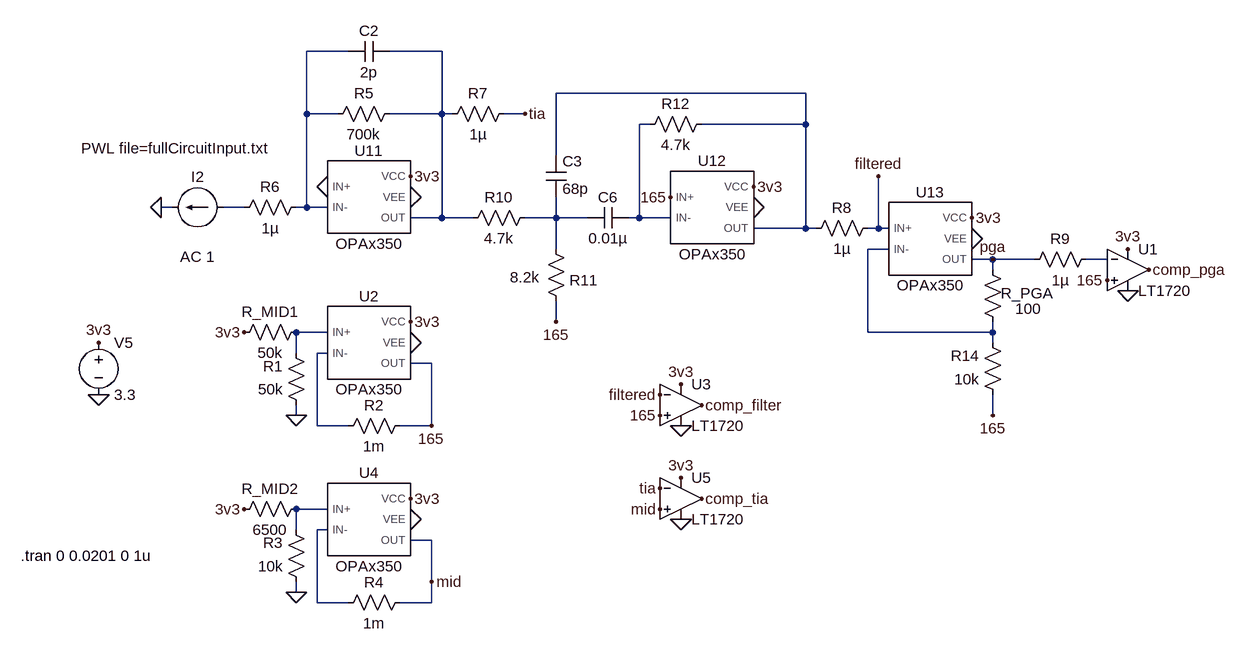
[diagram p0: schematic circuit_full.asc]
circuit_full.asc, the LTspice schematic file:
Version 4.1
SHEET 1 1996 1696
WIRE 0 800 -64 800
WIRE 144 800 64 800
WIRE 704 864 320 864
WIRE -64 896 -64 800
WIRE -16 896 -64 896
WIRE 144 896 144 800
WIRE 144 896 64 896
WIRE 160 896 144 896
WIRE 272 896 240 896
WIRE 464 912 448 912
WIRE 704 912 704 864
WIRE 704 912 544 912
WIRE 320 960 320 864
WIRE -272 1040 -288 1040
WIRE -160 1040 -192 1040
WIRE -64 1040 -64 896
WIRE -64 1040 -80 1040
WIRE -32 1040 -64 1040
WIRE 144 1056 144 896
WIRE 144 1056 96 1056
WIRE 192 1056 144 1056
WIRE 320 1056 320 1024
WIRE 320 1056 272 1056
WIRE 368 1056 320 1056
WIRE 448 1056 448 912
WIRE 448 1056 432 1056
WIRE 496 1056 448 1056
WIRE 704 1072 704 912
WIRE 704 1072 624 1072
WIRE 720 1072 704 1072
WIRE 816 1072 816 992
WIRE 816 1072 800 1072
WIRE 832 1072 816 1072
WIRE 320 1104 320 1056
WIRE 832 1104 800 1104
WIRE 992 1120 960 1120
WIRE 1056 1120 992 1120
WIRE 1168 1120 1136 1120
WIRE 992 1136 992 1120
WIRE 320 1216 320 1184
WIRE -32 1232 -80 1232
WIRE 800 1232 800 1104
WIRE 992 1232 992 1216
WIRE 992 1232 800 1232
WIRE 992 1248 992 1232
WIRE -80 1264 -80 1232
WIRE -32 1264 -48 1264
WIRE 128 1280 96 1280
WIRE -80 1360 -80 1344
WIRE 992 1360 992 1328
WIRE -48 1376 -48 1264
WIRE 0 1376 -48 1376
WIRE 128 1376 128 1280
WIRE 128 1376 80 1376
WIRE -32 1504 -80 1504
WIRE -80 1536 -80 1504
WIRE -32 1536 -48 1536
WIRE 128 1552 96 1552
WIRE 128 1616 128 1552
WIRE -80 1632 -80 1616
WIRE -48 1648 -48 1536
WIRE 0 1648 -48 1648
WIRE 128 1648 128 1616
WIRE 128 1648 80 1648
FLAG 96 992 3v3
FLAG 96 1024 0
FLAG -288 1040 0
FLAG 624 1008 3v3
FLAG 624 1040 0
FLAG 816 992 filtered
FLAG -384 1328 0
FLAG -384 1248 3v3
FLAG 320 1216 165
FLAG 496 1024 165
FLAG 960 1056 3v3
FLAG 960 1088 0
FLAG 992 1360 165
FLAG 1168 1152 165
FLAG 1200 1104 3v3
FLAG 1200 1168 0
FLAG 480 1328 filtered
FLAG 1232 1136 comp_pga
FLAG 544 1344 comp_filter
FLAG -32 1008 0
FLAG 480 1360 165
FLAG 512 1312 3v3
FLAG 512 1376 0
FLAG 992 1120 pga
FLAG -80 1360 0
FLAG -160 1232 3v3
FLAG 96 1216 3v3
FLAG 96 1248 0
FLAG -80 1632 0
FLAG -160 1504 3v3
FLAG 96 1488 3v3
FLAG 96 1520 0
FLAG 128 1616 mid
FLAG 128 1376 165
FLAG 544 1488 comp_tia
FLAG 512 1456 3v3
FLAG 512 1520 0
FLAG 480 1504 mid
FLAG 272 896 tia
FLAG 480 1472 tia
SYMBOL res 80 880 R90
WINDOW 0 0 56 VBottom 2
WINDOW 3 32 56 VTop 2
SYMATTR InstName R5
SYMATTR Value 700k
SYMBOL cap 64 784 R90
WINDOW 0 0 32 VBottom 2
WINDOW 3 32 32 VTop 2
SYMATTR InstName C2
SYMATTR Value 2p
SYMBOL res -64 1024 R90
WINDOW 0 0 56 VBottom 2
WINDOW 3 32 56 VTop 2
SYMATTR InstName R6
SYMATTR Value 1µ
SYMBOL current -192 1040 R90
WINDOW 0 -32 40 VBottom 2
WINDOW 3 -107 75 VTop 2
WINDOW 123 60 40 VTop 2
WINDOW 39 0 0 Left 0
SYMATTR InstName I2
SYMATTR Value PWL file=fullCircuitInput.txt
SYMATTR Value2 AC 1
SYMBOL LTSpiceModels\\sbom071e\\OPAx350 32 1024 R0
SYMATTR InstName U11
SYMBOL res 288 1040 R90
WINDOW 0 0 56 VBottom 2
WINDOW 3 32 56 VTop 2
SYMATTR InstName R10
SYMATTR Value 4.7k
SYMBOL res 336 1200 R180
WINDOW 0 -49 48 Left 2
WINDOW 3 41 53 Left 2
SYMATTR InstName R11
SYMATTR Value 8.2k
SYMBOL cap 304 960 R0
WINDOW 0 26 9 Left 2
WINDOW 3 26 51 Left 2
SYMATTR InstName C3
SYMATTR Value 68p
SYMBOL cap 432 1040 R90
WINDOW 0 0 32 VBottom 2
WINDOW 3 32 32 VTop 2
SYMATTR InstName C6
SYMATTR Value 0.01µ
SYMBOL res 560 896 R90
WINDOW 0 0 56 VBottom 2
WINDOW 3 32 56 VTop 2
SYMATTR InstName R12
SYMATTR Value 4.7k
SYMBOL LTSpiceModels\\sbom071e\\OPAx350 560 1040 R0
SYMATTR InstName U12
SYMBOL voltage -384 1232 R0
WINDOW 123 0 0 Left 0
WINDOW 39 0 0 Left 0
SYMATTR InstName V5
SYMATTR Value 3.3
SYMBOL LTSpiceModels\\sbom071e\\OPAx350 896 1088 R0
SYMATTR InstName U13
SYMBOL res 1008 1232 R180
WINDOW 0 -77 60 Left 2
WINDOW 3 -59 36 Left 2
SYMATTR InstName R_PGA
SYMATTR Value 100
SYMBOL res 1008 1344 R180
WINDOW 0 36 76 Left 2
WINDOW 3 36 40 Left 2
SYMATTR InstName R14
SYMATTR Value 10k
SYMBOL Comparators\\LT1720 1200 1072 R0
SYMATTR InstName U1
SYMBOL Comparators\\LT1720 512 1280 R0
SYMATTR InstName U3
SYMBOL LTSpiceModels\\sbom071e\\OPAx350 32 1248 R0
SYMATTR InstName U2
SYMBOL res -64 1216 R90
WINDOW 0 0 56 VBottom 2
WINDOW 3 32 56 VTop 2
SYMATTR InstName R_MID1
SYMATTR Value 50k
SYMBOL res -64 1360 R180
WINDOW 0 36 76 Left 2
WINDOW 3 36 40 Left 2
SYMATTR InstName R1
SYMATTR Value 50k
SYMBOL res 96 1360 R90
WINDOW 0 0 56 VBottom 2
WINDOW 3 32 56 VTop 2
SYMATTR InstName R2
SYMATTR Value 1m
SYMBOL LTSpiceModels\\sbom071e\\OPAx350 32 1520 R0
SYMATTR InstName U4
SYMBOL res -64 1488 R90
WINDOW 0 0 56 VBottom 2
WINDOW 3 32 56 VTop 2
SYMATTR InstName R_MID2
SYMATTR Value 6500
SYMBOL res -64 1632 R180
WINDOW 0 36 76 Left 2
WINDOW 3 36 40 Left 2
SYMATTR InstName R3
SYMATTR Value 10k
SYMBOL res 96 1632 R90
WINDOW 0 0 56 VBottom 2
WINDOW 3 32 56 VTop 2
SYMATTR InstName R4
SYMATTR Value 1m
SYMBOL Comparators\\LT1720 512 1424 R0
SYMATTR InstName U5
SYMBOL res 256 880 R90
WINDOW 0 0 56 VBottom 2
WINDOW 3 32 56 VTop 2
SYMATTR InstName R7
SYMATTR Value 1µ
SYMBOL res 816 1056 R90
WINDOW 0 0 56 VBottom 2
WINDOW 3 32 56 VTop 2
SYMATTR InstName R8
SYMATTR Value 1µ
SYMBOL res 1152 1104 R90
WINDOW 0 0 56 VBottom 2
WINDOW 3 32 56 VTop 2
SYMATTR InstName R9
SYMATTR Value 1µ
TEXT -504 1576 Left 2 !.tran 0 0.0201 0 1u

The netlist it stands for:
* circuit_full.asc
R5 N002 N001 700k
C2 N002 N001 2p
R6 N001 N005 1µ
I2 N005 0 PWL file=fullCircuitInput.txt AC 1
X§U11 0 N001 3v3 0 N002 OPAx350  ; pins IN+ IN- VCC VEE OUT
R10 N006 N002 4.7k
R11 165 N006 8.2k
C3 N003 N006 68p
C6 N004 N006 0.01µ
R12 N003 N004 4.7k
X§U12 165 N004 3v3 0 N003 OPAx350  ; pins IN+ IN- VCC VEE OUT
V5 3v3 0 3.3
X§U13 filtered N007 3v3 0 pga OPAx350  ; pins IN+ IN- VCC VEE OUT
R_PGA N007 pga 100
R14 165 N007 10k
X§U1 165 N008 3v3 0 comp_pga LT1720  ; pins In+ In- V+ V- OUT
X§U3 165 filtered 3v3 0 comp_filter LT1720  ; pins In+ In- V+ V- OUT
X§U2 N009 N010 3v3 0 165 OPAx350  ; pins IN+ IN- VCC VEE OUT
R_MID1 N009 3v3 50k
R1 0 N009 50k
R2 165 N010 1m
X§U4 N011 N012 3v3 0 mid OPAx350  ; pins IN+ IN- VCC VEE OUT
R_MID2 N011 3v3 6500
R3 0 N011 10k
R4 mid N012 1m
X§U5 mid tia 3v3 0 comp_tia LT1720  ; pins In+ In- V+ V- OUT
R7 tia N002 1µ
R8 filtered N003 1µ
R9 N008 pga 1µ
.tran 0 0.0201 0 1u
.lib C:\Users\jpulu\OneDrive\Área de Trabalho\TCC\LTSpiceModels\sbom071e\OPAx350.LIB
.lib LT1720.sub
.backanno
.end